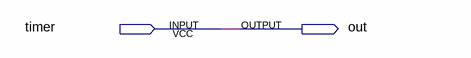
[diagram p0: schematic sheet]
// Quartus schematic tpf_test_0+1.bdf as structural Verilog: 0 symbols, 2 pins
module \tpf_test_0+1  (
  input  timer,
  output out
);


  assign out = timer;
endmodule
